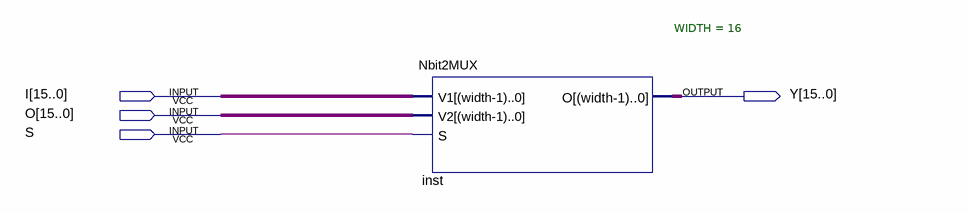
[diagram p0: schematic sheet]
// Quartus schematic 16bit2_1.bdf as structural Verilog: 1 symbols, 4 pins
module \16bit2_1  (
  input  [15:0] I,
  input  [15:0] O,
  input  S,
  output [15:0] Y
);

  Nbit2MUX #(.WIDTH(16)) inst (.V1(I), .V2(O), .S(S), .O(Y));
endmodule
